# EAGLE design example (EAGLE 6.1)
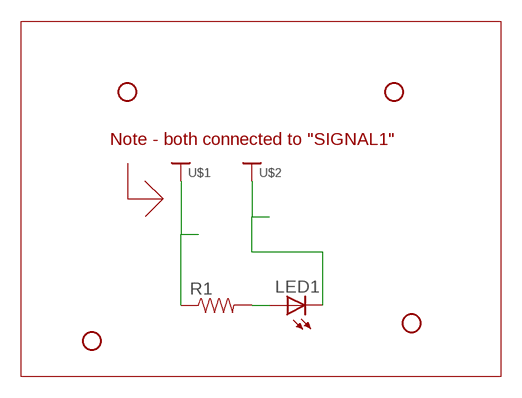
[diagram p0: schematic, sheet 1]

## Parts
JP1  STAND-OFF  [STAND-OFF]
JP2  STAND-OFF  [STAND-OFF]
JP3  STAND-OFF  [STAND-OFF]
JP4  STAND-OFF  [STAND-OFF]
LED1  LED-FKIT-1206  [FKIT-LED-1206]
R1  RESISTOR0805-RES  [0805]
U$1  HIGHCURRENTPAD2  [HIGH_CURRENT_PAD2]
U$2  HIGHCURRENTPAD2  [HIGH_CURRENT_PAD2]

## Nets
N$1: LED1.A R1.2
SIGNAL1: LED1.C R1.1 U$1.P$1 U$2.P$1

## Notes on the sheet
- Note - both connected to "SIGNAL1"

## Library data of the parts
JP1-JP4 = SparkFun:STAND-OFF: Stand Off This is the mechanical footprint for a #4 phillips button head screw. Use the keepout ring to avoid running the screw head into surrounding components. SKU : PRT-00447
LED1 = SparkFun:LED: LEDs Standard schematic elements and footprints for 5mm, 3mm, 1206, and 0603 sized LEDs. 5mm - Spark Fun Electronics SKU : COM-00529 (and others)
R1 = SparkFun:RESISTOR: Resistor Basic schematic elements and footprints for 0603, 1206, and PTH resistors.
U$1 U$2 = Taylor:HIGHCURRENTPAD2

## Board
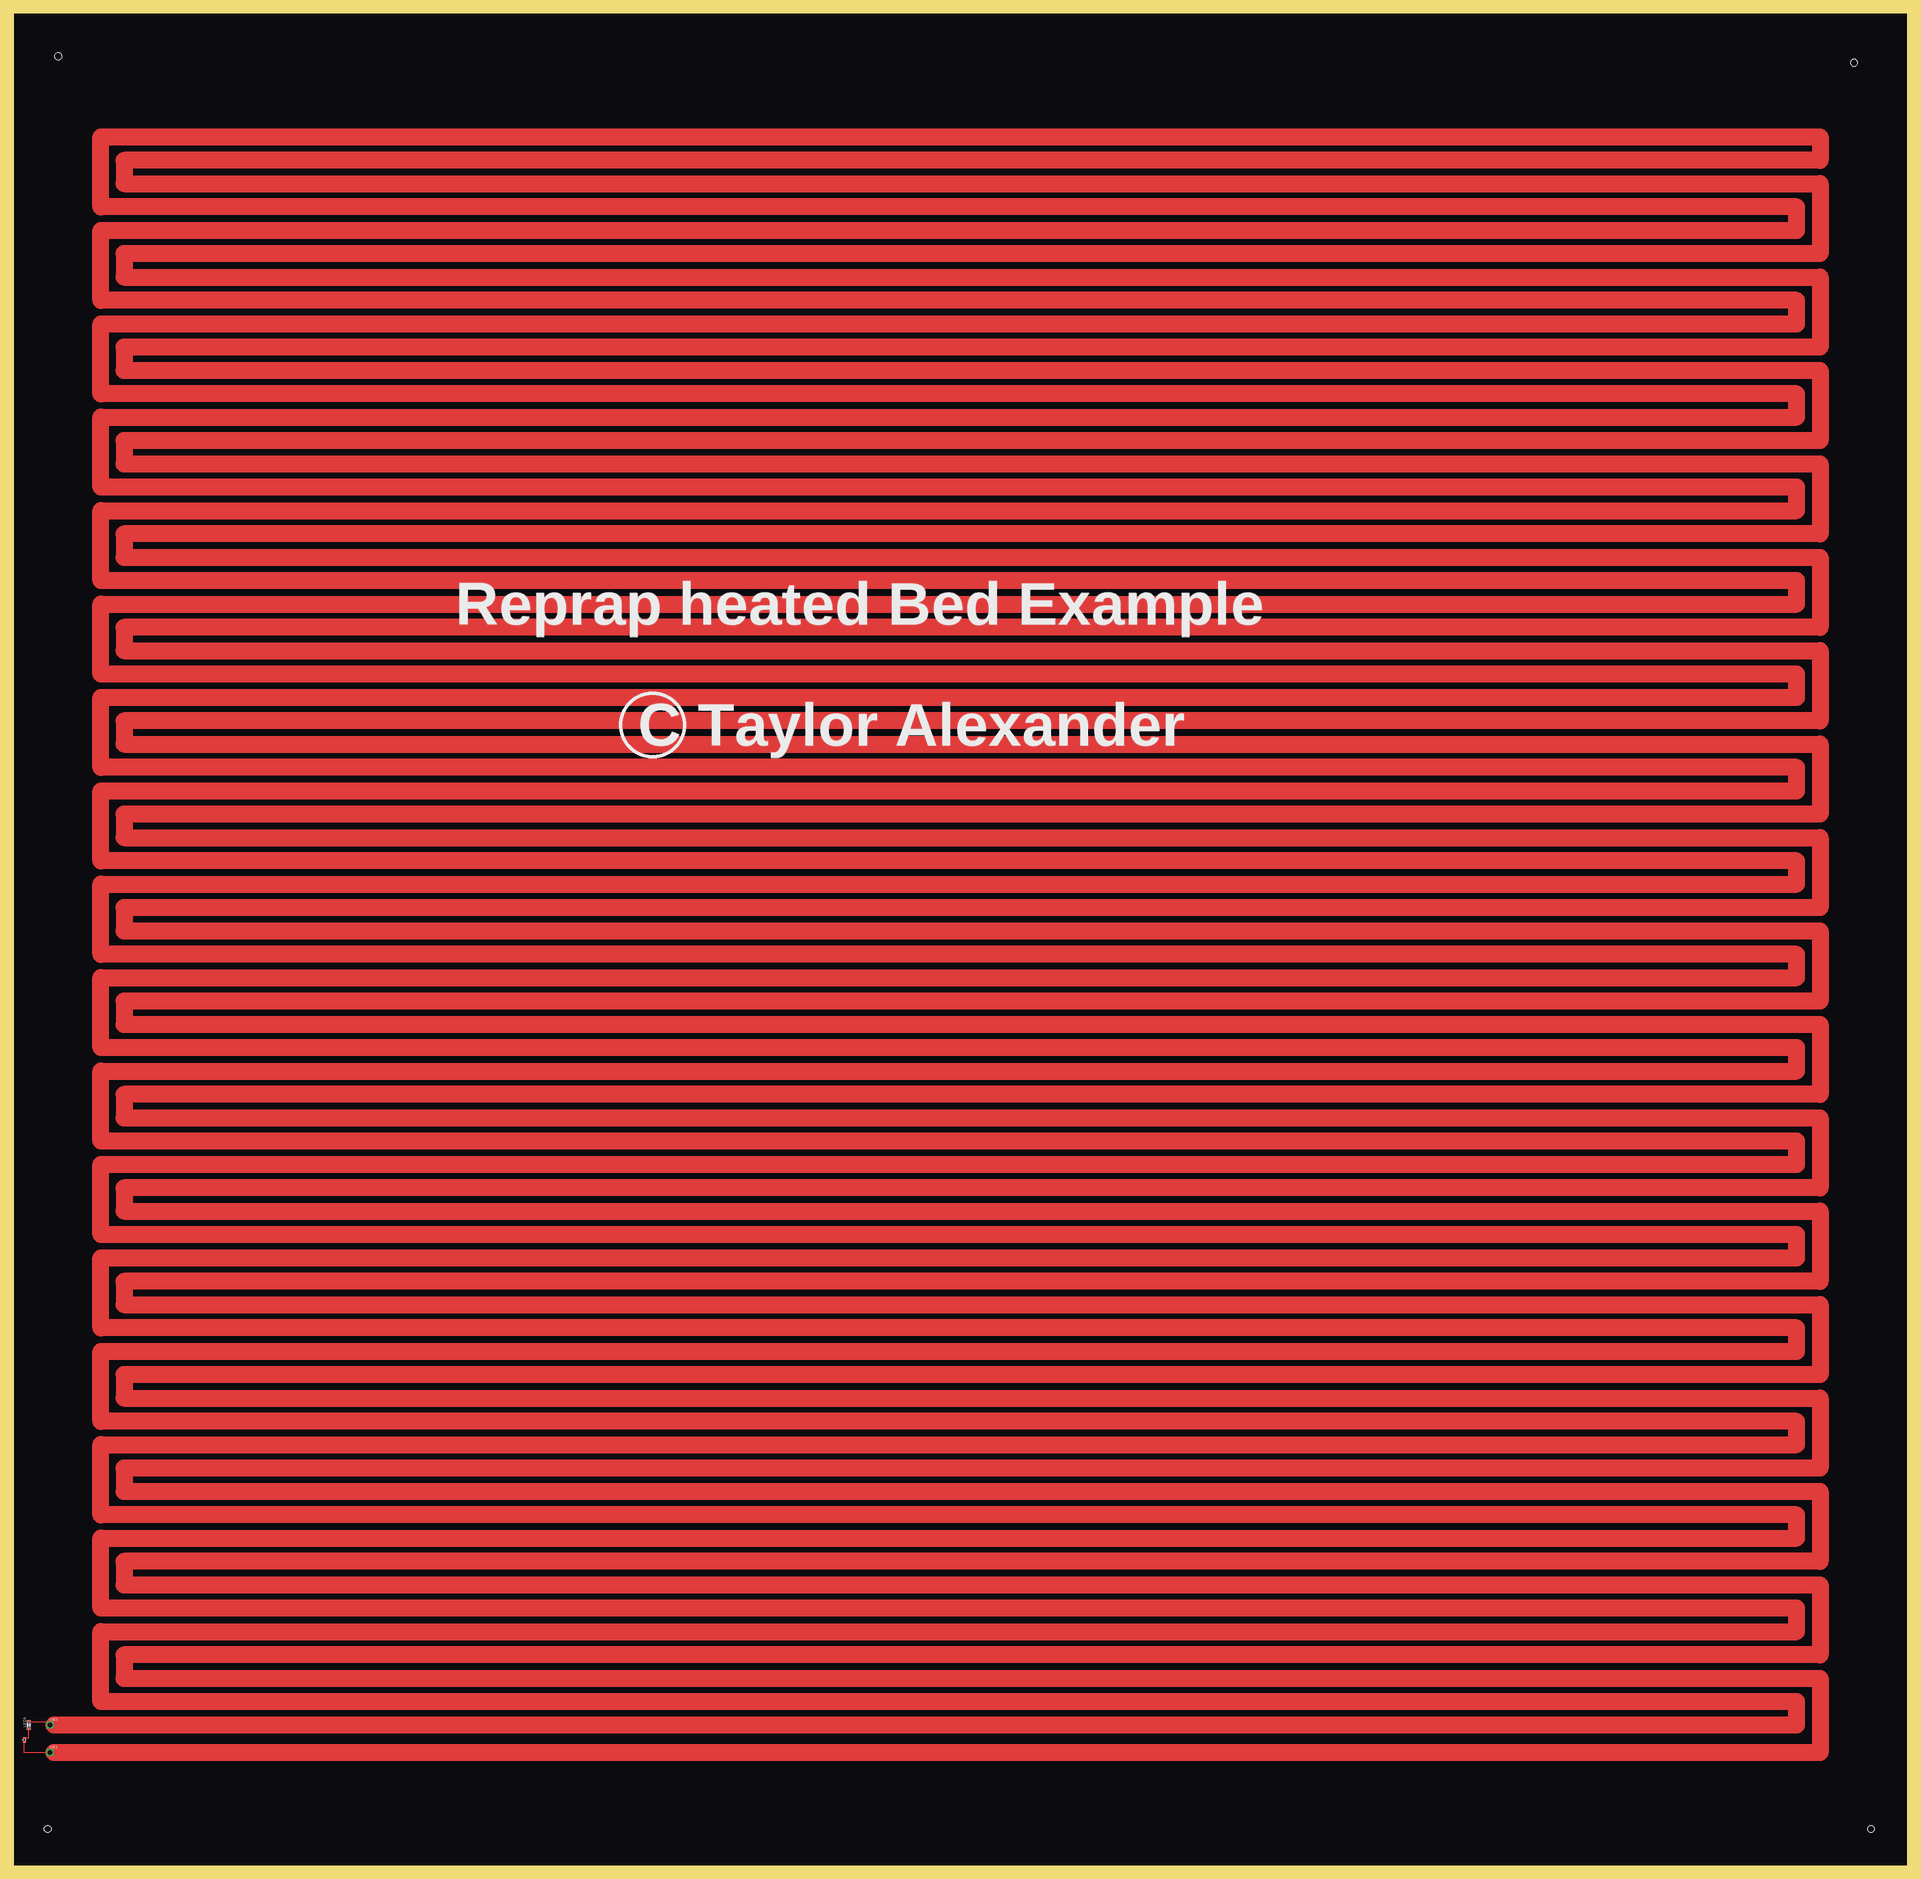
[diagram p1: board, top side]

Size 900 x 880 mm. Coordinates in mm from the lower left corner, seen from the top.
Outline: 0,0 900,0 900,880 0,880 0,0
Copper layers (1*16): Top 0.035mm / dielectric 1.5mm / Bottom 0.035mm
Design rules: minimum track width 10mil, minimum drill 24mil, track to track 8mil, track to pad 8mil, pad to pad 8mil, via to via 8mil, smd to smd 8mil, copper to edge 40mil, drill to drill 8mil, minimum pad ring 10mil, minimum via ring 8mil, stop-mask expansion 4mil, vias tented up to drill 0mil, thermal gap 10mil

### Footprints (pad centres in the part's own frame; a part is rotated, then mirrored left to right if it is on the bottom)
STAND-OFF = hole 3.302: 0,0
FKIT-LED-1206 = smd 1.6 x 1.803: A -1.422,0; C 1.422,0
0805 = smd 0.8 x 1.2: 1 -0.9,0; 2 0.9,0
HIGH_CURRENT_PAD2 = drill 2.032 pad 2.54 square: P$1 0,0

### Placement (x,y rotation side)
JP1  20,21 0 top
JP2  879,21 0 top
JP3  25,856 0 top
JP4  871,853 0 top
LED1  11,70 90 top
R1  9,63 90 top
U$1  21,57 0 top
U$2  21,70 0 top

### Tracks (layer width: path | path; a pad name or v marks a point on that pad's centre or on a via)
N$1
  Top 0.406: R1.2 11,63.9 LED1.A
SIGNAL1
  Top 0.406: R1.1 9,57 U$1.P$1 23,57 | LED1.C 21,71.42 U$2.P$1 23,70
  Top 8: 23,70 844,70 844,81 45,81 45,114 844,114 844,125 45,125 45,158 844,158 844,169 45,169 45,202 844,202 844,213 45,213 45,246 844,246 844,257 45,257 45,290 844,290 844,301 45,301 45,334 844,334 844,345 45,345 45,378 844,378 844,389 45,389 45,422 844,422 844,433 45,433 45,466 844,466 844,477 45,477 45,510 844,510 844,521 45,521 45,554 844,554 844,565 45,565 45,598 844,598 844,609 45,609 45,642 844,642 844,653 45,653 45,686 844,686 844,697 45,697 45,730 844,730 844,741 45,741 45,774 844,774 844,785 45,785 45,818 855,818 855,807 56,807 56,796 855,796 855,763 56,763 56,752 855,752 855,719 56,719 56,708 855,708 855,675 56,675 56,664 855,664 855,631 56,631 56,620 855,620 855,587 56,587 56,576 855,576 855,543 56,543 56,532 855,532 855,499 56,499 56,488 855,488 855,455 56,455 56,444 855,444 855,411 56,411 56,400 855,400 855,367 56,367 56,356 855,356 855,323 56,323 56,312 855,312 855,279 56,279 56,268 855,268 855,235 56,235 56,224 855,224 855,191 56,191 56,180 855,180 855,147 56,147 56,136 855,136 855,103 56,103 56,92 855,92 855,57 23,57

### Text on the board
tPlace: Reprap heated Bed Example | C Taylor Alexander